# Altium schematic sheet Sheet1.SchDoc
size A4
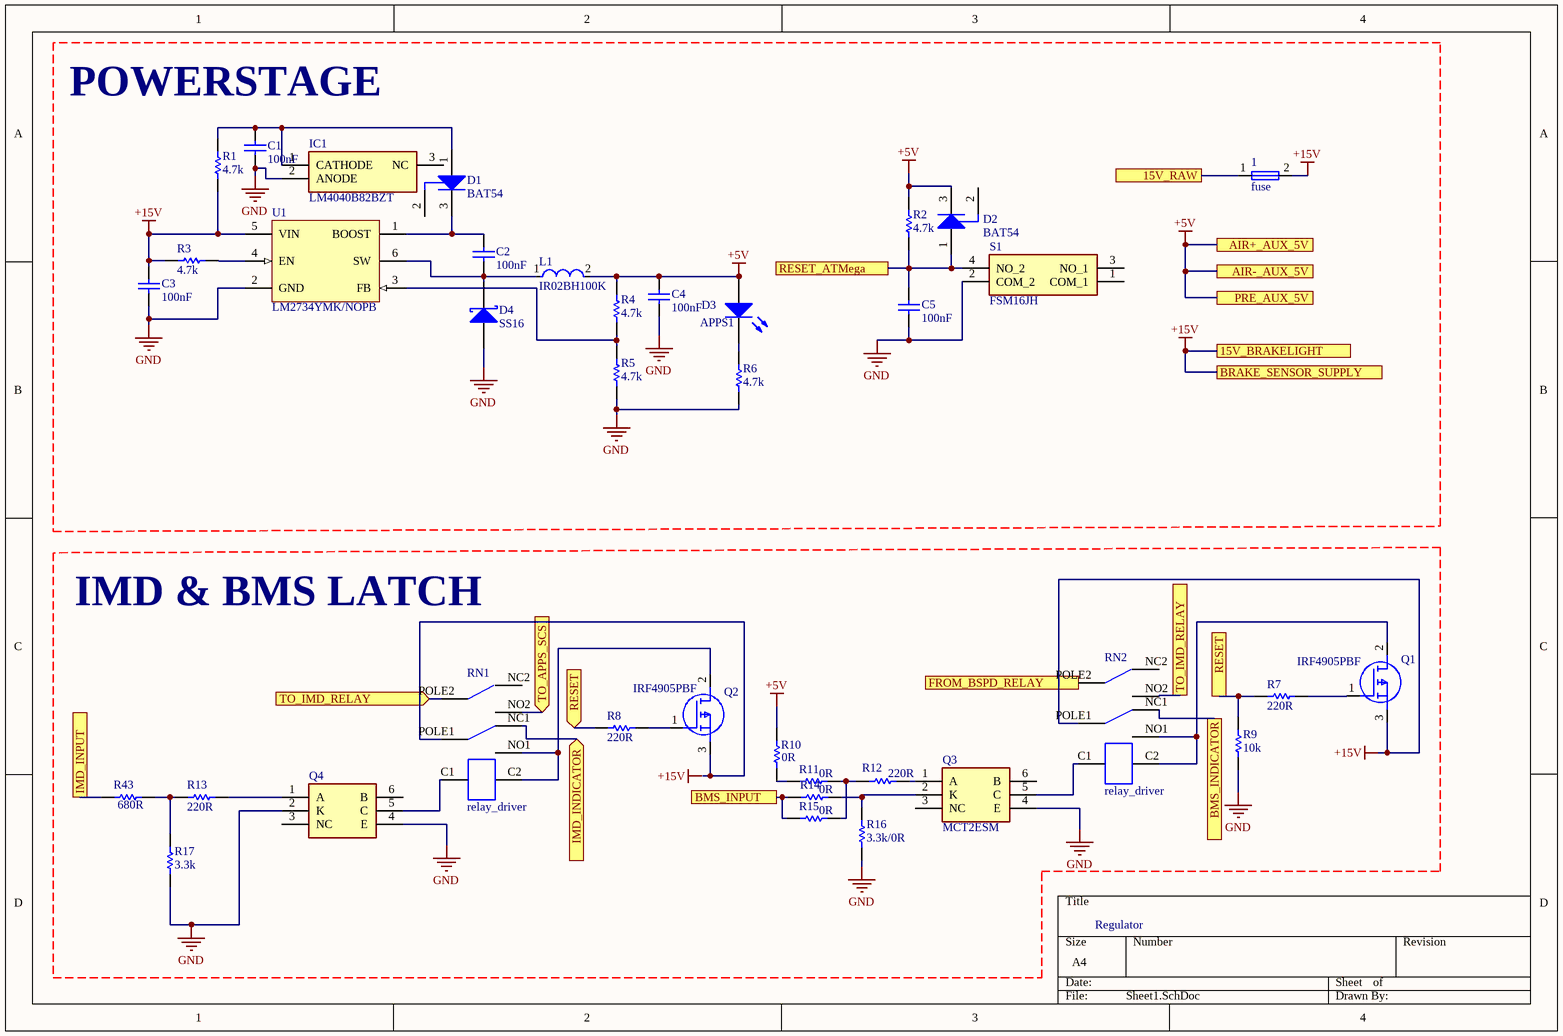
[diagram p0: Sheet1.SchDoc]

## Parts
1  fuse  [fuse]
C1  100nF  [KEMT-1206-2_N]
C2  100nF  [KEMT-1206-2_N]
C3  100nF  [KEMT-1206-2_N]
C4  100nF  [KEMT-1206-2_N]
C5  100nF  [KEMT-1206-2_N]
D1  BAT54  [INF-SOT23_N]
D2  BAT54  [INF-SOT23_N]
D3  APPS1  [3.2X1.6X1.1]
D4  SS16  [FAIR-SMA-2_B_V]
IC1  LM4040B82BZT  [SOT95P237X112-3N]
L1  IR02BH100K  [FP-IR02-MFG]
Q1  IRF4905PBF  [TO254P469X1042X1967-3P]
Q2  IRF4905PBF  [TO254P469X1042X1967-3P]
Q3  MCT2ESM  [SOT254P916X480-6N]
Q4  MCT2ESM  [SOT254P916X480-6N]  (value not drawn)
R1  4.7k  [R1206]
R2  4.7k  [R1206]
R3  4.7k  [R1206]
R4  4.7k  [R1206]
R5  4.7k  [R1206]
R6  4.7k  [R1206]
R7  220R  [R1206]
R8  220R  [R1206]
R9  10k  [R1206]
R10  0R  [R1206]
R11  0R  [R1206]
R12  220R  [R1206]
R13  220R  [R1206]
R14  0R  [R1206]
R15  0R  [R1206]
R16  3.3k/0R  [R1206]
R17  3.3k  [R1206]
R43  680R  [R1206]
RN1  relay_driver  [OMRON_12_RELAY]
RN2  relay_driver  [OMRON_12_RELAY]
S1  FSM16JH  [FSM16JH]
U1  LM2734YMK/NOPB  [DDC0006A_N]

## Blocks framed on the sheet
POWERSTAGE: 1 C1-C5 D1-D4 IC1 L1 R1-R6 S1 U1
IMD & BMS LATCH: Q1-Q4 R7-R17 R43 RN1 RN2

## Ports
15V_BRAKELIGHT, 15V_RAW, AIR+_AUX_5V, AIR-_AUX_5V, BMS_INDICATOR, BMS_INPUT, BRAKE_SENSOR_SUPPLY, FROM_BSPD_RELAY, IMD_INDICATOR (in), IMD_INPUT, PRE_AUX_5V, RESET, RESET (in), RESET_ATMega, TO_APPS_SCS (in), TO_IMD_RELAY, TO_IMD_RELAY (in)

## Nets
+5V: C4.2 D2.3(K) D3.1(A) L1.2 R2.2 R4.2 R10.2 ; port AIR+_AUX_5V, port AIR-_AUX_5V, port PRE_AUX_5V
+15V: 1.2 C3.2 Q1.3(S) R1.2 R3.1 RN2.POLE1 U1.5(VIN) ; port BRAKE_SENSOR_SUPPLY, port 15V_BRAKELIGHT
GND: C1.1 C3.1 C4.1 C5.1 D4.1(A) IC1.2(ANODE) Q3.4(E) Q4.2(K) Q4.4(E) R5.1 R6.1 R9.1 R16.1 R17.1 S1.2(COM_2) U1.2(GND)
15V_RAW: 1.1 ; port 15V_RAW
BMS_INDICATOR: RN2.NC1 ; port BMS_INDICATOR
BMS_INPUT: R14.1 R15.1 ; port BMS_INPUT
FROM_BSPD_RELAY: RN2.POLE2 ; port FROM_BSPD_RELAY
IMD_INDICATOR: RN1.NC1 ; port IMD_INDICATOR
IMD_INPUT: R43.1 ; port IMD_INPUT
RESET: R7.1 R8.1 R9.2 ; port RESET
RESET_ATMega: C5.2 D2.1(A) R2.1 S1.4(NO_2) ; port RESET_ATMega
TO_APPS_SCS: RN1.NO2 ; port TO_APPS_SCS
TO_IMD_RELAY: RN1.POLE2 RN2.NO2 ; port TO_IMD_RELAY
NetC1_2: C1.2 D1.1(A) IC1.1(CATHODE) R1.1
NetC2_1: C2.1 D4.2(K) L1.1 U1.6(SW)
NetC2_2: C2.2 D1.3(K) U1.1(BOOST)
NetD3_2: D3.2(K) R6.2
NetQ1_1: Q1.1(G) R7.2
NetQ1_2: Q1.2(D) RN2.C2 RN2.NO1
NetQ2_1: Q2.1(G) R8.2
NetQ2_2: Q2.2(D) RN1.C2 RN1.NO1
NetQ2_3: Q2.3(S) RN1.POLE1
NetQ3_1: Q3.1(A) R12.2
NetQ3_2: Q3.2(K) R14.2 R16.2
NetQ3_5: Q3.5(C) RN2.C1
NetQ4_1: Q4.1(A) R13.2
NetQ4_5: Q4.5(C) RN1.C1
NetR3_2: R3.2 U1.4(EN)
NetR4_1: R4.1 R5.2 U1.3(FB)
NetR10_1: R10.1 R11.1
NetR11_2: R11.2 R12.1 R15.2
NetR13_1: R13.1 R17.2 R43.2

Not connected (* = marked no-connect by the designer): D1 2(NC); D2 2(NC); IC1 3(NC); Q3 3(NC) 6(B); Q4 3(NC) 6(B); RN1 NC2; RN2 NC2; S1 1(COM_1) 3(NO_1)

## Notes on the sheet
- Regulator
- Labels drawn without touching a wire or pin: +15V

## Library data of the parts
C1-C5 = CMP-1037-04202-2: CAP, Ceramic, 0.1 uF, +/- 10%, 50 V, -55 to 125 degC, 1206 (3216 Metric), RoHS, Tape and Reel; Manufacturer: Kemet; Voltage Rating: 50V; Capacitance: 0.1µF; Product Range: KEMET-CSeries; SVHC: ToBeAdvised; Dielectric Characteristic: X7R; Capacitor Case Style: 1206[3216Metric]; Package Reference: 1206-2; Package Description: 2-Leads SMD, Body 3.2 x 1.6 mm; Packaging: Tape&Reel; Operating Temperature Max: 125degC; Capacitance Tolerance: ±10%; Datasheet URL: https://datasheet.ciiva.com/6125/1725438-6125494.pdf; Manufacturer URL: http://www.kemet.com/; Operating Temperature Min: -55degC; Datasheet Version: Jul-13
D1 D2 = CMP-1182-00010-1: Silicon Schottky Diode, SOT23, Reel, Green; Manufacturer: Infineon; VF (max): 800Â mV; Configuration: Single; IF (max): 200Â mA; CT (max): 10Â pF; Green: TRUE; VR (max): 30Â V; PartNumber: BAT54; ComponentLink2URL: http://www.infineon.com/dgdl/bat54series.pdf?folderId=db3a30431400ef68011425f1ca2505e3&fileId=db3a304314dca3890115190b74210ea6; ComponentLink3Description: Package Specification; PackageVersion: Apr-08; PackageDescription: 3-Pin Small Outline Transistor Package, 1.3 x 2.9 mm Body, 0.95 mm Pitch; ComponentLink1Description: Manufacturer URL; ComponentLink1URL: http://www.infineon.com/; Mounting Technology: Surface Mount; Packing: Reel; ComponentLink2Description: Datasheet; PackageReference: SOT23; ComponentLink3URL: http://www.infineon.com/dgdl/SOT23-Package_Overview.pdf?folderId=db3a30431936bc4b0119532290053c66&fileId=db3a30431936bc4b0119533468123c85
D3 = LED2: Typical RED, GREEN, YELLOW, AMBER GaAs LED; Published: 8-Jun-2000; LatestRevisionDate: 17-Jul-2002; LatestRevisionNote: Re-released for DXP Platform.; PackageVersion: Feb-2002; PackageReference: 3.2X1.6X1.1; Publisher: Altium Limited; PackageDescription: SM LED; 2 Flat Leads
D4 = CMP-2000-07149-1: Schottky Rectifier, 700 mV, -65 to 125 degC, 2-Pin SMA, RoHS, Tape and Reel; Manufacturer: FairchildSemiconductor; Type: SchottkyDiode; Peak Average Forward Current: 1@Ta=75CA; Peak Reverse Current: 200uA; Peak Non-Repetitive Surge Current: 40A; Configuration: Single; Peak Forward Voltage: 0.7V; Peak Reverse Repetitive Voltage: 60V; Package: 2DO-214AC; Datasheet URL: http://www.mouser.com/ds/2/149/SS16-196707.pdf; Package Description: 2-Pin Surface Mount Device, Body 4.375 x 2.725 mm; Packaging: Tape&Reel; Package Reference: SMA-2; Mounting: SurfaceMount; Operating Temperature: -65to125°C; Datasheet Version: Rev. 1.9, 01/2015; Mounting Technology: SurfaceMount; Category: Rectifier; Manufacturer URL: https://www.fairchildsemi.com/
IC1 = LM4040B25IDBZT: Integrated Circuit; Manufacturer_Name: Texas Instruments; Datasheet Link: https://www.ti.com/lit/gpn/LM4040; Height: 1.12mm; Manufacturer_Part_Number: LM4040B25IDBZT; Mouser Part Number: 595-LM4040B25IDBZT; Mouser Price/Stock: https://www.mouser.com/Search/Refine.aspx?Keyword=595-LM4040B25IDBZT; Arrow Part Number: LM4040B25IDBZT; Arrow Price/Stock: https://www.arrow.com/en/products/lm4040b25idbzt/texas-instruments
L1 = CMP-03630-000001-1: IR-2 10 10% B08; Obsolete Part: true; Manufacturer: Vishay Dale; Core Material: Iron; Value: 10uH; Test Frequency: 7.9MHz; Saturation Current: 130mA; Series Resistance: 3.7Ω; Q Factor: 55; Self Resonant Frequency: 50MHz; Device Class L2: Inductors; ComponentLink2Description: Datasheet; Temperature Range Low: -55°C; Digikey Description: IR-2 10 10% B08; Temperature Range High: +105°C; Inductance: 10uH; Height: 3.05mm; Package: IR02; Tolerance: 10%; Device Class L1: Passive Components; Category: Ind; Device Class L3: Fixed Inductors; RoHS: TRUE; Octopart: https://octopart.com/ir02bh100k-vishay+dale-39675774; Temperature: -55°C to +105°C; Manufacturer Part Number: IR02BH100K; Ipc Land Pattern Name: CAPAD1147W70L838D305; Lead Free: Yes; ComponentLink2URL: https://datasheet.ciiva.com/8536/ir-8536517.pdf; Automotive: No; Mouser Description: Fixed Inductors 10uH 10%
Q1 Q2 = IRF4905PBF: MOSFET (P-Channel); Manufacturer_Name: Infineon; Datasheet Link: http://docs-emea.rs-online.com/webdocs/0791/0900766b807910f2.pdf; Height: 4.69mm; Manufacturer_Part_Number: IRF4905PBF; Mouser Part Number: 942-IRF4905PBF; Mouser Price/Stock: https://www.mouser.co.uk/ProductDetail/Infineon-IR/IRF4905PBF/?qs=9%252BKlkBgLFf39l0HsWdxvdw%3D%3D; Arrow Part Number: IRF4905PBF; Arrow Price/Stock: https://www.arrow.com/en/products/irf4905pbf/infineon-technologies-ag
Q3 Q4 = MCT2ESM: Phototransistor; Manufacturer_Name: ON Semiconductor; Datasheet Link: https://www.onsemi.com/pub/Collateral/MCT2EM-D.PDF; Height: 4.8mm; Manufacturer_Part_Number: MCT2ESM; Mouser Part Number: 512-MCT2ESM; Mouser Price/Stock: https://www.mouser.co.uk/ProductDetail/ON-Semiconductor-Fairchild/MCT2ESM/?qs=nW0pe8qlIZjLnc6UyUzYTw%3D%3D; Arrow Part Number: MCT2ESM; Arrow Price/Stock: https://www.arrow.com/en/products/mct2esm/on-semiconductor
R1-R16 R43 = RES: Part Number: CRCW120647K0FKEA; Manufacturer: Vishay Dale
R17 = CMP-2003-02213-1: Part Number: CRCW120647K0FKEA; Manufacturer: Vishay Dale
S1 = FSM16JH: Switch; Manufacturer_Name: TE Connectivity; Datasheet Link: https://www.te.com/commerce/DocumentDelivery/DDEController?Action=showdoc&DocId=Customer+Drawing%7F1825910%7FC10%7Fpdf%7FEnglish%7FENG_CD_1825910_C10.pdf%7F3-1825910-1; Height: 17.3mm; Manufacturer_Part_Number: FSM16JH; Mouser Part Number: 506-FSM16JH; Mouser Price/Stock: https://www.mouser.co.uk/ProductDetail/TE-Connectivity-PB/FSM16JH/?qs=eA0sQYb2Mifk48vugSh4aw%3D%3D; Arrow Part Number: FSM16JH; Arrow Price/Stock: https://www.arrow.com/en/products/fsm16jh/te-connectivity
U1 = CMP-0069-01201-3: 1A Load Step-Down DC-DC Regulator, 6-pin Tiny SOT23, Pb-Free; Manufacturer: Texas Instruments; PackageTopMarking: SFEB*XTT; PowerWise: N; CompType: Switcher; RoHS: Y; PackageReference: DDC0006A; Code_JEDEC: MO-193-AA; ComponentLink1Description: Datasheet URL; PinCount: 6; PackageDescription: Molded TSOT, 2.97 x 1.65 x 0.87mm Body, 6 Lead, 0.95mm Pitch; ComponentLink1URL: http://www.ti.com/general/docs/lit/getliterature.tsp?genericPartNumber=LM2734&fileType=pdf; Code_IPC: SOT26A-6